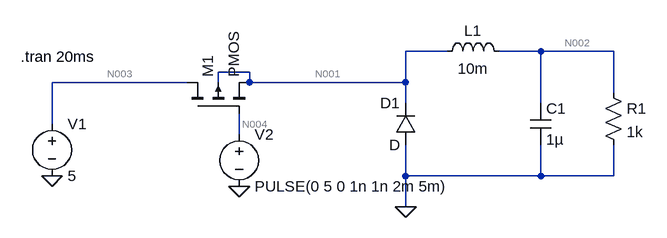
[diagram p0: schematic Buck_converter.asc]
Buck_converter.asc, the LTspice schematic file:
Version 4
SHEET 1 880 680
WIRE 432 64 368 64
WIRE 576 64 512 64
WIRE 688 64 576 64
WIRE 128 96 80 96
WIRE 32 112 -176 112
WIRE 80 112 80 96
WIRE 128 112 128 96
WIRE 368 112 368 64
WIRE 368 112 128 112
WIRE 688 128 688 64
WIRE 368 144 368 112
WIRE 576 144 576 64
WIRE -176 176 -176 112
WIRE 112 192 112 160
WIRE 368 256 368 208
WIRE 576 256 576 208
WIRE 576 256 368 256
WIRE 688 256 688 208
WIRE 688 256 576 256
WIRE 368 304 368 256
FLAG -176 256 0
FLAG 112 272 0
FLAG 368 304 0
SYMBOL pmos4 32 160 R270
SYMATTR InstName M1
SYMBOL diode 384 208 R180
WINDOW 0 24 64 Left 2
WINDOW 3 24 0 Left 2
SYMATTR InstName D1
SYMBOL ind 416 80 R270
WINDOW 0 32 56 VTop 2
WINDOW 3 5 56 VBottom 2
SYMATTR InstName L1
SYMATTR Value 10m
SYMBOL cap 560 144 R0
SYMATTR InstName C1
SYMATTR Value 1µ
SYMBOL res 672 112 R0
SYMATTR InstName R1
SYMATTR Value 1k
SYMBOL voltage -176 160 R0
SYMATTR InstName V1
SYMATTR Value 5
SYMBOL voltage 112 176 R0
WINDOW 123 0 0 Left 0
WINDOW 39 0 0 Left 0
SYMATTR InstName V2
SYMATTR Value PULSE(0 5 0 1n 1n 2m 5m)
TEXT -224 72 Left 2 !.tran 20ms

The netlist it stands for:
* Buck_converter.asc
M1 N003 N004 N001 N001 PMOS
D1 0 N001 D
L1 N001 N002 10m
C1 N002 0 1µ
R1 N002 0 1k
V1 N003 0 5
V2 N004 0 PULSE(0 5 0 1n 1n 2m 5m)
.model D D
.lib standard.dio
.model NMOS NMOS
.model PMOS PMOS
.lib standard.mos
.tran 20ms
.backanno
.end

* Results of the author's LTspice run, read from the files saved beside the schematic
* Operating Point, zero values left out:
*   V(n003) = 5 V
*   V(n001) = 4.307 V
*   V(n002) = 4.307 V
*   Id(M1) = 4.327 mA
*   Ib(M1) = -4.263 mA
*   Is(M1) = -64.46 µA
*   I(D1) = -4.317 pA
*   I(L1) = 4.307 mA
*   I(R1) = 4.307 mA
*   I(V1) = -4.307 mA
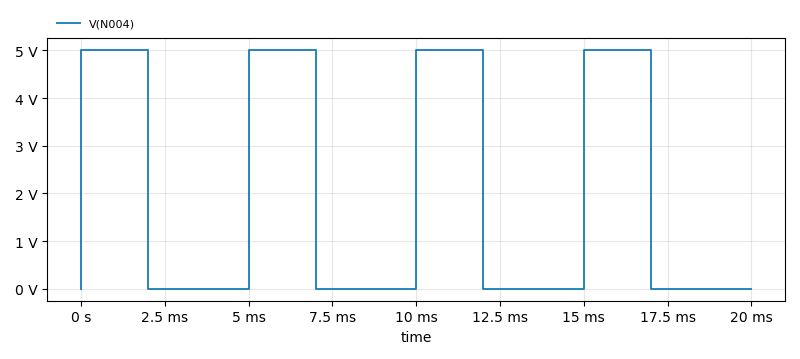
[diagram p1: Transient Analysis of Buck_converter.asc, plotted from the saved traces]
* Transient Analysis, 1 run:
*   V(N004): min 0 V, max 5 V, average 2 V, rms 3.162 V, last 0 V